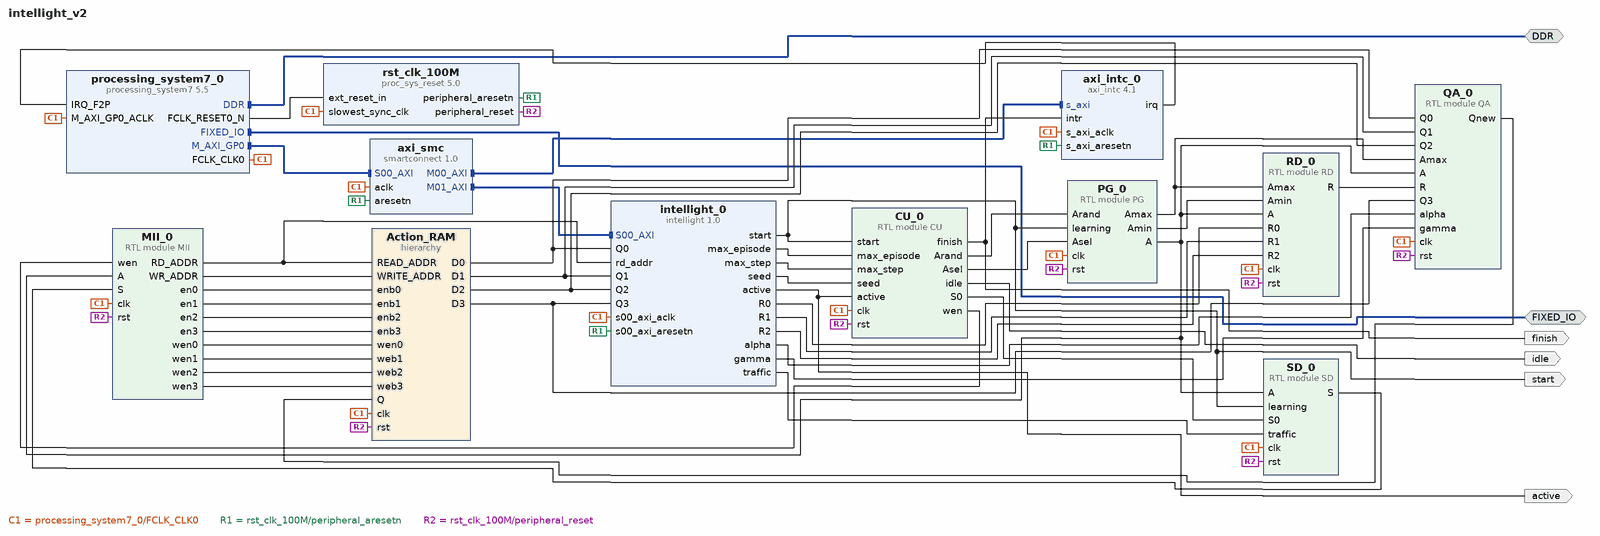
[diagram p0: block diagram of the top level]
# Vivado block design intellight_v2, xc7z020clg400-1, Vivado 2022.1
create_bd_design intellight_v2

create_bd_intf_port -mode Master -vlnv xilinx.com:interface:ddrx_rtl:1.0 DDR
create_bd_intf_port -mode Master -vlnv xilinx.com:display_processing_system7:fixedio_rtl:1.0 FIXED_IO
create_bd_port -dir O active
create_bd_port -dir O finish
create_bd_port -dir O idle
create_bd_port -dir O start

create_bd_cell -type hier Action_RAM
create_bd_cell -type ip -vlnv xilinx.com:user:intellight:1.0 intellight_0
create_bd_cell -type ip -vlnv xilinx.com:ip:axi_intc:4.1 axi_intc_0
set_property -dict [list \
  CONFIG.C_DISABLE_SYNCHRONIZERS 1 \
  CONFIG.C_HAS_FAST 0 \
  CONFIG.C_IRQ_CONNECTION 1 \
  CONFIG.C_IRQ_IS_LEVEL 1 \
  CONFIG.C_MB_CLK_NOT_CONNECTED 1 \
] [get_bd_cells axi_intc_0]
create_bd_cell -type ip -vlnv xilinx.com:ip:smartconnect:1.0 axi_smc
set_property -dict {CONFIG.NUM_MI 2 CONFIG.NUM_SI 1} [get_bd_cells axi_smc]
create_bd_cell -type ip -vlnv xilinx.com:ip:processing_system7:5.5 processing_system7_0
set_property -dict [list \
  CONFIG.PCW_APU_PERIPHERAL_FREQMHZ 650 \
  CONFIG.PCW_CRYSTAL_PERIPHERAL_FREQMHZ 50 \
  CONFIG.PCW_ENET0_ENET0_IO {MIO 16 .. 27} \
  CONFIG.PCW_ENET0_GRP_MDIO_ENABLE 1 \
  CONFIG.PCW_ENET0_GRP_MDIO_IO {MIO 52 .. 53} \
  CONFIG.PCW_ENET0_PERIPHERAL_ENABLE 1 \
  CONFIG.PCW_ENET0_RESET_ENABLE 1 \
  CONFIG.PCW_ENET0_RESET_IO {MIO 9} \
  CONFIG.PCW_ENET_RESET_ENABLE 1 \
  CONFIG.PCW_ENET_RESET_SELECT {Share reset pin} \
  CONFIG.PCW_FPGA0_PERIPHERAL_FREQMHZ 160 \
  CONFIG.PCW_FPGA1_PERIPHERAL_FREQMHZ 50 \
  CONFIG.PCW_GPIO_MIO_GPIO_ENABLE 1 \
  CONFIG.PCW_GPIO_MIO_GPIO_IO MIO \
  CONFIG.PCW_I2C_RESET_ENABLE 1 \
  CONFIG.PCW_IRQ_F2P_INTR 1 \
  CONFIG.PCW_M_AXI_GP0_FREQMHZ 10 \
  CONFIG.PCW_PERIPHERAL_BOARD_PRESET part0 \
  CONFIG.PCW_PRESET_BANK1_VOLTAGE {LVCMOS 1.8V} \
  CONFIG.PCW_QSPI_GRP_FBCLK_ENABLE 1 \
  CONFIG.PCW_QSPI_GRP_FBCLK_IO {MIO 8} \
  CONFIG.PCW_QSPI_GRP_SINGLE_SS_ENABLE 1 \
  CONFIG.PCW_QSPI_GRP_SINGLE_SS_IO {MIO 1 .. 6} \
  CONFIG.PCW_QSPI_PERIPHERAL_ENABLE 1 \
  CONFIG.PCW_QSPI_QSPI_IO {MIO 1 .. 6} \
  CONFIG.PCW_SD0_GRP_CD_ENABLE 1 \
  CONFIG.PCW_SD0_GRP_CD_IO {MIO 47} \
  CONFIG.PCW_SD0_GRP_WP_ENABLE 0 \
  CONFIG.PCW_SD0_PERIPHERAL_ENABLE 1 \
  CONFIG.PCW_SD0_SD0_IO {MIO 40 .. 45} \
  CONFIG.PCW_SDIO_PERIPHERAL_FREQMHZ 50 \
  CONFIG.PCW_SINGLE_QSPI_DATA_MODE x4 \
  CONFIG.PCW_UART0_PERIPHERAL_ENABLE 1 \
  CONFIG.PCW_UART0_UART0_IO {MIO 14 .. 15} \
  CONFIG.PCW_UART1_PERIPHERAL_ENABLE 0 \
  CONFIG.PCW_UART_PERIPHERAL_FREQMHZ 100 \
  CONFIG.PCW_UIPARAM_DDR_BUS_WIDTH {16 Bit} \
  CONFIG.PCW_UIPARAM_DDR_FREQ_MHZ 525 \
  CONFIG.PCW_UIPARAM_DDR_PARTNO {MT41J256M16 RE-125} \
  CONFIG.PCW_USB0_PERIPHERAL_ENABLE 1 \
  CONFIG.PCW_USB0_RESET_ENABLE 1 \
  CONFIG.PCW_USB0_RESET_IO {MIO 46} \
  CONFIG.PCW_USB0_USB0_IO {MIO 28 .. 39} \
  CONFIG.PCW_USB_RESET_ENABLE 1 \
  CONFIG.PCW_USB_RESET_SELECT {Share reset pin} \
  CONFIG.PCW_USE_FABRIC_INTERRUPT 1 \
] [get_bd_cells processing_system7_0]
# 507 more settings of processing_system7_0 are not shown: defaults, MIO pin electricals, DDR timing, and values the tool derives
create_bd_cell -type ip -vlnv xilinx.com:ip:proc_sys_reset:5.0 rst_clk_100M
create_bd_cell -type module -reference CU CU_0
create_bd_cell -type module -reference MII MII_0
create_bd_cell -type module -reference QA QA_0
create_bd_cell -type module -reference RD RD_0
create_bd_cell -type module -reference SD SD_0
create_bd_cell -type module -reference PG PG_0

# ---- hierarchy /Action_RAM ----
current_bd_instance /Action_RAM
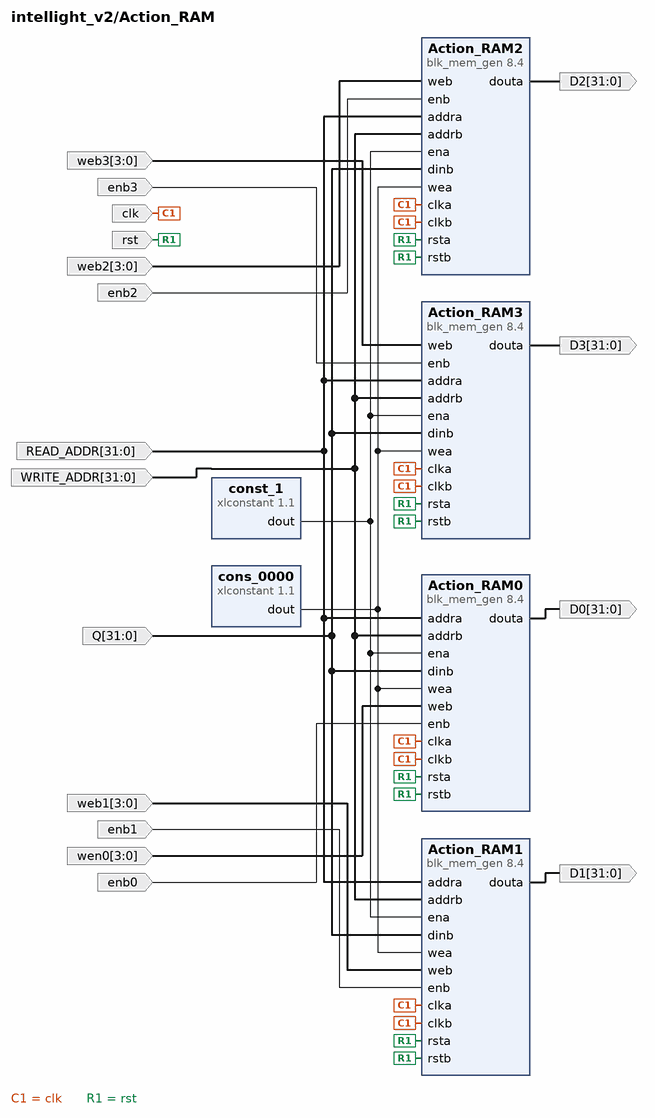
[diagram p1: block diagram inside /Action_RAM]
create_bd_pin -dir I -type clk clk
create_bd_pin -dir I -type rst rst
create_bd_pin -dir I -from 31 -to 0 READ_ADDR
create_bd_pin -dir O -from 31 -to 0 D0
create_bd_pin -dir I -from 3 -to 0 wen0
create_bd_pin -dir I -from 31 -to 0 WRITE_ADDR
create_bd_pin -dir I -from 31 -to 0 Q
create_bd_pin -dir O -from 31 -to 0 D1
create_bd_pin -dir I -from 3 -to 0 web1
create_bd_pin -dir O -from 31 -to 0 D2
create_bd_pin -dir I -from 3 -to 0 web2
create_bd_pin -dir O -from 31 -to 0 D3
create_bd_pin -dir I -from 3 -to 0 web3
create_bd_pin -dir I enb0
create_bd_pin -dir I enb1
create_bd_pin -dir I enb2
create_bd_pin -dir I enb3

create_bd_cell -type ip -vlnv xilinx.com:ip:xlconstant:1.1 const_1
create_bd_cell -type ip -vlnv xilinx.com:ip:xlconstant:1.1 cons_0000
set_property -dict {CONFIG.CONST_VAL 0 CONFIG.CONST_WIDTH 4} [get_bd_cells cons_0000]
create_bd_cell -type ip -vlnv xilinx.com:ip:blk_mem_gen:8.4 Action_RAM0
set_property -dict [list \
  CONFIG.Assume_Synchronous_Clk true \
  CONFIG.EN_SAFETY_CKT true \
  CONFIG.Enable_32bit_Address true \
  CONFIG.Enable_A Use_ENA_Pin \
  CONFIG.Enable_B Use_ENB_Pin \
  CONFIG.Fill_Remaining_Memory_Locations false \
  CONFIG.Load_Init_File false \
  CONFIG.Memory_Type True_Dual_Port_RAM \
  CONFIG.Operating_Mode_A READ_FIRST \
  CONFIG.Operating_Mode_B READ_FIRST \
  CONFIG.Port_B_Clock 100 \
  CONFIG.Port_B_Enable_Rate 100 \
  CONFIG.Port_B_Write_Rate 50 \
  CONFIG.Read_Width_A 32 \
  CONFIG.Read_Width_B 32 \
  CONFIG.Register_PortA_Output_of_Memory_Primitives false \
  CONFIG.Register_PortB_Output_of_Memory_Core false \
  CONFIG.Register_PortB_Output_of_Memory_Primitives false \
  CONFIG.Use_RSTA_Pin true \
  CONFIG.Use_RSTB_Pin true \
  CONFIG.Write_Depth_A 4096 \
  CONFIG.Write_Width_A 32 \
  CONFIG.Write_Width_B 32 \
  CONFIG.use_bram_block Stand_Alone \
] [get_bd_cells Action_RAM0]
create_bd_cell -type ip -vlnv xilinx.com:ip:blk_mem_gen:8.4 Action_RAM1
set_property -dict [list \
  CONFIG.Assume_Synchronous_Clk true \
  CONFIG.EN_SAFETY_CKT true \
  CONFIG.Enable_32bit_Address true \
  CONFIG.Enable_A Use_ENA_Pin \
  CONFIG.Enable_B Use_ENB_Pin \
  CONFIG.Fill_Remaining_Memory_Locations false \
  CONFIG.Load_Init_File false \
  CONFIG.Memory_Type True_Dual_Port_RAM \
  CONFIG.Operating_Mode_A READ_FIRST \
  CONFIG.Operating_Mode_B READ_FIRST \
  CONFIG.Port_B_Clock 100 \
  CONFIG.Port_B_Enable_Rate 100 \
  CONFIG.Port_B_Write_Rate 50 \
  CONFIG.Read_Width_A 32 \
  CONFIG.Read_Width_B 32 \
  CONFIG.Register_PortA_Output_of_Memory_Primitives false \
  CONFIG.Register_PortB_Output_of_Memory_Core false \
  CONFIG.Register_PortB_Output_of_Memory_Primitives false \
  CONFIG.Use_RSTA_Pin true \
  CONFIG.Use_RSTB_Pin true \
  CONFIG.Write_Depth_A 4096 \
  CONFIG.Write_Width_A 32 \
  CONFIG.Write_Width_B 32 \
  CONFIG.use_bram_block Stand_Alone \
] [get_bd_cells Action_RAM1]
create_bd_cell -type ip -vlnv xilinx.com:ip:blk_mem_gen:8.4 Action_RAM2
set_property -dict [list \
  CONFIG.Assume_Synchronous_Clk true \
  CONFIG.EN_SAFETY_CKT true \
  CONFIG.Enable_32bit_Address true \
  CONFIG.Enable_A Use_ENA_Pin \
  CONFIG.Enable_B Use_ENB_Pin \
  CONFIG.Fill_Remaining_Memory_Locations false \
  CONFIG.Load_Init_File false \
  CONFIG.Memory_Type True_Dual_Port_RAM \
  CONFIG.Operating_Mode_A READ_FIRST \
  CONFIG.Operating_Mode_B READ_FIRST \
  CONFIG.Port_B_Clock 100 \
  CONFIG.Port_B_Enable_Rate 100 \
  CONFIG.Port_B_Write_Rate 50 \
  CONFIG.Read_Width_A 32 \
  CONFIG.Read_Width_B 32 \
  CONFIG.Register_PortA_Output_of_Memory_Primitives false \
  CONFIG.Register_PortB_Output_of_Memory_Core false \
  CONFIG.Register_PortB_Output_of_Memory_Primitives false \
  CONFIG.Use_RSTA_Pin true \
  CONFIG.Use_RSTB_Pin true \
  CONFIG.Write_Depth_A 4096 \
  CONFIG.Write_Width_A 32 \
  CONFIG.Write_Width_B 32 \
  CONFIG.use_bram_block Stand_Alone \
] [get_bd_cells Action_RAM2]
create_bd_cell -type ip -vlnv xilinx.com:ip:blk_mem_gen:8.4 Action_RAM3
set_property -dict [list \
  CONFIG.Assume_Synchronous_Clk true \
  CONFIG.EN_SAFETY_CKT true \
  CONFIG.Enable_32bit_Address true \
  CONFIG.Enable_A Use_ENA_Pin \
  CONFIG.Enable_B Use_ENB_Pin \
  CONFIG.Fill_Remaining_Memory_Locations false \
  CONFIG.Load_Init_File false \
  CONFIG.Memory_Type True_Dual_Port_RAM \
  CONFIG.Operating_Mode_A READ_FIRST \
  CONFIG.Operating_Mode_B READ_FIRST \
  CONFIG.Port_B_Clock 100 \
  CONFIG.Port_B_Enable_Rate 100 \
  CONFIG.Port_B_Write_Rate 50 \
  CONFIG.Read_Width_A 32 \
  CONFIG.Read_Width_B 32 \
  CONFIG.Register_PortA_Output_of_Memory_Primitives false \
  CONFIG.Register_PortB_Output_of_Memory_Core false \
  CONFIG.Register_PortB_Output_of_Memory_Primitives false \
  CONFIG.Use_RSTA_Pin true \
  CONFIG.Use_RSTB_Pin true \
  CONFIG.Write_Depth_A 4096 \
  CONFIG.Write_Width_A 32 \
  CONFIG.Write_Width_B 32 \
  CONFIG.use_bram_block Stand_Alone \
] [get_bd_cells Action_RAM3]

# ---- connections ----

current_bd_instance /Action_RAM
connect_bd_net -net MII_0_READ_ADDR [get_bd_pins READ_ADDR] \
  [get_bd_pins Action_RAM0/addra] [get_bd_pins Action_RAM1/addra] [get_bd_pins Action_RAM2/addra] \
  [get_bd_pins Action_RAM3/addra]
connect_bd_net -net MII_0_WRITE_ADDR [get_bd_pins WRITE_ADDR] \
  [get_bd_pins Action_RAM0/addrb] [get_bd_pins Action_RAM1/addrb] [get_bd_pins Action_RAM2/addrb] \
  [get_bd_pins Action_RAM3/addrb]
connect_bd_net -net MII_0_wen0 [get_bd_pins wen0] [get_bd_pins Action_RAM0/web]
connect_bd_net -net MII_0_wen1 [get_bd_pins web1] [get_bd_pins Action_RAM1/web]
connect_bd_net -net MII_0_wen2 [get_bd_pins web2] [get_bd_pins Action_RAM2/web]
connect_bd_net -net MII_0_wen3 [get_bd_pins web3] [get_bd_pins Action_RAM3/web]
connect_bd_net -net RAM1_douta [get_bd_pins Action_RAM1/douta] [get_bd_pins D1]
connect_bd_net -net RAM2_douta [get_bd_pins Action_RAM2/douta] [get_bd_pins D2]
connect_bd_net -net RAM3_douta [get_bd_pins Action_RAM3/douta] [get_bd_pins D3]
connect_bd_net -net blk_mem_gen_0_douta [get_bd_pins Action_RAM0/douta] [get_bd_pins D0]
connect_bd_net -net clka_0_1 [get_bd_pins clk] \
  [get_bd_pins Action_RAM0/clka] [get_bd_pins Action_RAM0/clkb] [get_bd_pins Action_RAM1/clka] [get_bd_pins Action_RAM1/clkb] \
  [get_bd_pins Action_RAM2/clka] [get_bd_pins Action_RAM2/clkb] [get_bd_pins Action_RAM3/clka] [get_bd_pins Action_RAM3/clkb]
connect_bd_net [get_bd_pins const_1/dout] \
  [get_bd_pins Action_RAM0/ena] [get_bd_pins Action_RAM1/ena] [get_bd_pins Action_RAM2/ena] [get_bd_pins Action_RAM3/ena]
connect_bd_net -net dinb_0_1 [get_bd_pins Q] \
  [get_bd_pins Action_RAM0/dinb] [get_bd_pins Action_RAM1/dinb] [get_bd_pins Action_RAM2/dinb] [get_bd_pins Action_RAM3/dinb]
connect_bd_net -net enb1_1 [get_bd_pins enb1] [get_bd_pins Action_RAM1/enb]
connect_bd_net -net enb2_1 [get_bd_pins enb2] [get_bd_pins Action_RAM2/enb]
connect_bd_net -net enb3_1 [get_bd_pins enb3] [get_bd_pins Action_RAM3/enb]
connect_bd_net [get_bd_pins enb0] [get_bd_pins Action_RAM0/enb]
connect_bd_net -net rsta_0_1 [get_bd_pins rst] \
  [get_bd_pins Action_RAM0/rsta] [get_bd_pins Action_RAM0/rstb] [get_bd_pins Action_RAM1/rsta] [get_bd_pins Action_RAM1/rstb] \
  [get_bd_pins Action_RAM2/rsta] [get_bd_pins Action_RAM2/rstb] [get_bd_pins Action_RAM3/rsta] [get_bd_pins Action_RAM3/rstb]
connect_bd_net -net xlconstant_0_dout [get_bd_pins cons_0000/dout] \
  [get_bd_pins Action_RAM0/wea] [get_bd_pins Action_RAM1/wea] [get_bd_pins Action_RAM2/wea] [get_bd_pins Action_RAM3/wea]

current_bd_instance /
connect_bd_intf_net [get_bd_intf_pins axi_smc/M00_AXI] [get_bd_intf_pins axi_intc_0/s_axi]
connect_bd_intf_net [get_bd_intf_pins axi_smc/M01_AXI] [get_bd_intf_pins intellight_0/S00_AXI]
connect_bd_intf_net [get_bd_intf_ports DDR] [get_bd_intf_pins processing_system7_0/DDR]
connect_bd_intf_net [get_bd_intf_ports FIXED_IO] [get_bd_intf_pins processing_system7_0/FIXED_IO]
connect_bd_intf_net [get_bd_intf_pins processing_system7_0/M_AXI_GP0] [get_bd_intf_pins axi_smc/S00_AXI]
connect_bd_net [get_bd_pins Action_RAM/D0] [get_bd_pins intellight_0/Q0] [get_bd_pins QA_0/Q0]
connect_bd_net [get_bd_pins Action_RAM/D1] [get_bd_pins intellight_0/Q1] [get_bd_pins QA_0/Q1]
connect_bd_net [get_bd_pins Action_RAM/D2] [get_bd_pins intellight_0/Q2] [get_bd_pins QA_0/Q2]
connect_bd_net [get_bd_pins Action_RAM/D3] [get_bd_pins intellight_0/Q3] [get_bd_pins QA_0/Q3]
connect_bd_net [get_bd_pins CU_0/Arand] [get_bd_pins PG_0/Arand]
connect_bd_net [get_bd_pins CU_0/Asel] [get_bd_pins PG_0/Asel]
connect_bd_net [get_bd_pins CU_0/S0] [get_bd_pins SD_0/S0]
connect_bd_net [get_bd_pins CU_0/finish] [get_bd_ports finish] [get_bd_pins axi_intc_0/intr]
connect_bd_net [get_bd_pins CU_0/idle] [get_bd_ports idle]
connect_bd_net [get_bd_pins CU_0/wen] [get_bd_pins MII_0/wen]
connect_bd_net -net MII_0_READ_ADDR [get_bd_pins MII_0/RD_ADDR] [get_bd_pins Action_RAM/READ_ADDR] [get_bd_pins intellight_0/rd_addr]
connect_bd_net -net MII_0_WRITE_ADDR [get_bd_pins MII_0/WR_ADDR] [get_bd_pins Action_RAM/WRITE_ADDR]
connect_bd_net [get_bd_pins MII_0/en0] [get_bd_pins Action_RAM/enb0]
connect_bd_net [get_bd_pins MII_0/en1] [get_bd_pins Action_RAM/enb1]
connect_bd_net [get_bd_pins MII_0/en2] [get_bd_pins Action_RAM/enb2]
connect_bd_net [get_bd_pins MII_0/en3] [get_bd_pins Action_RAM/enb3]
connect_bd_net [get_bd_pins MII_0/wen0] [get_bd_pins Action_RAM/wen0]
connect_bd_net [get_bd_pins MII_0/wen1] [get_bd_pins Action_RAM/web1]
connect_bd_net [get_bd_pins MII_0/wen2] [get_bd_pins Action_RAM/web2]
connect_bd_net [get_bd_pins MII_0/wen3] [get_bd_pins Action_RAM/web3]
connect_bd_net [get_bd_pins PG_0/A] [get_bd_pins MII_0/A] [get_bd_pins QA_0/A] [get_bd_pins RD_0/A] [get_bd_pins SD_0/A]
connect_bd_net [get_bd_pins PG_0/Amax] [get_bd_pins QA_0/Amax] [get_bd_pins RD_0/Amax]
connect_bd_net [get_bd_pins PG_0/Amin] [get_bd_pins RD_0/Amin]
connect_bd_net [get_bd_pins QA_0/Qnew] [get_bd_pins Action_RAM/Q]
connect_bd_net [get_bd_pins RD_0/R] [get_bd_pins QA_0/R]
connect_bd_net [get_bd_pins SD_0/S] [get_bd_pins MII_0/S]
connect_bd_net [get_bd_pins axi_intc_0/irq] [get_bd_pins processing_system7_0/IRQ_F2P]
connect_bd_net -net clka_0_1 [get_bd_pins processing_system7_0/FCLK_CLK0] \
  [get_bd_pins Action_RAM/clk] [get_bd_pins intellight_0/s00_axi_aclk] [get_bd_pins axi_intc_0/s_axi_aclk] \
  [get_bd_pins axi_smc/aclk] [get_bd_pins processing_system7_0/M_AXI_GP0_ACLK] [get_bd_pins rst_clk_100M/slowest_sync_clk] \
  [get_bd_pins CU_0/clk] [get_bd_pins MII_0/clk] [get_bd_pins QA_0/clk] [get_bd_pins RD_0/clk] [get_bd_pins SD_0/clk] \
  [get_bd_pins PG_0/clk]
connect_bd_net [get_bd_pins intellight_0/R0] [get_bd_pins RD_0/R0]
connect_bd_net [get_bd_pins intellight_0/R1] [get_bd_pins RD_0/R1]
connect_bd_net [get_bd_pins intellight_0/R2] [get_bd_pins RD_0/R2]
connect_bd_net [get_bd_pins intellight_0/active] [get_bd_ports active] [get_bd_pins CU_0/active]
connect_bd_net [get_bd_pins intellight_0/alpha] [get_bd_pins QA_0/alpha]
connect_bd_net [get_bd_pins intellight_0/gamma] [get_bd_pins QA_0/gamma]
connect_bd_net [get_bd_pins intellight_0/max_episode] [get_bd_pins CU_0/max_episode]
connect_bd_net [get_bd_pins intellight_0/max_step] [get_bd_pins CU_0/max_step]
connect_bd_net -net intellight_0_seed_16bit [get_bd_pins intellight_0/seed] [get_bd_pins CU_0/seed]
connect_bd_net [get_bd_pins intellight_0/start] [get_bd_ports start] [get_bd_pins CU_0/start] [get_bd_pins SD_0/learning] [get_bd_pins PG_0/learning]
connect_bd_net [get_bd_pins intellight_0/traffic] [get_bd_pins SD_0/traffic]
connect_bd_net [get_bd_pins processing_system7_0/FCLK_RESET0_N] [get_bd_pins rst_clk_100M/ext_reset_in]
connect_bd_net [get_bd_pins rst_clk_100M/peripheral_aresetn] \
  [get_bd_pins intellight_0/s00_axi_aresetn] [get_bd_pins axi_intc_0/s_axi_aresetn] [get_bd_pins axi_smc/aresetn]
connect_bd_net -net rsta_0_1 [get_bd_pins rst_clk_100M/peripheral_reset] \
  [get_bd_pins Action_RAM/rst] [get_bd_pins CU_0/rst] [get_bd_pins MII_0/rst] [get_bd_pins QA_0/rst] [get_bd_pins RD_0/rst] \
  [get_bd_pins SD_0/rst] [get_bd_pins PG_0/rst]
set_property HDL_ATTRIBUTE.BMM_INFO_PROCESSOR {arm > intellight PL_RAM/axi_bram_ctrl_0 intellight PL_RAM/axi_bram_ctrl_1 intellight PL_RAM/axi_bram_ctrl_2 intellight PL_RAM/axi_bram_ctrl_3} [get_bd_cells processing_system7_0]
set_property HDL_ATTRIBUTE.KEEP_HIERARCHY yes [get_bd_cells processing_system7_0]

# ---- address map ----
assign_bd_address -offset 0x41800000 -range 64K -target_address_space [get_bd_addr_spaces processing_system7_0/Data] [get_bd_addr_segs axi_intc_0/S_AXI/Reg]
assign_bd_address -offset 0x43C00000 -range 64K -target_address_space [get_bd_addr_spaces processing_system7_0/Data] [get_bd_addr_segs intellight_0/S00_AXI/S00_AXI_reg]

validate_bd_design
save_bd_design
